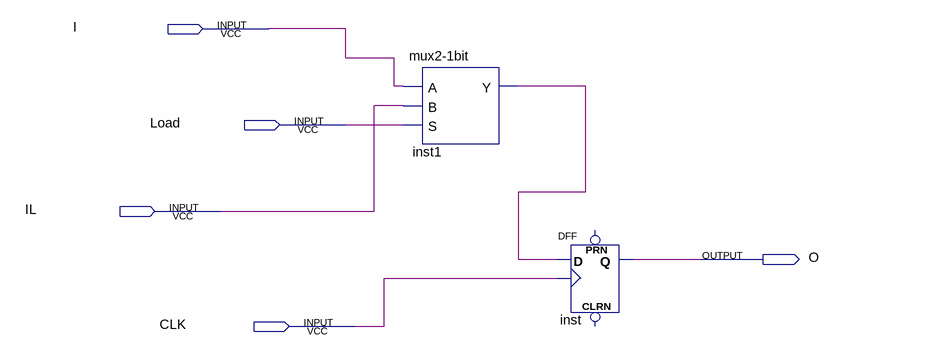
[diagram p0: schematic sheet]
// Quartus schematic RFC.bdf as structural Verilog: 2 symbols, 5 pins
module RFC (
  input  I,
  input  Load,
  input  IL,
  input  CLK,
  output O
);

  wire inst1_y;

  \mux2-1bit  inst1 (.A(I), .B(IL), .S(Load), .Y(inst1_y));
  DFF inst (.CLK(CLK), .D(inst1_y), .Q(O));  // open: CLRN, PRN
endmodule
